# EAGLE design ZippyLighthouseCircuit_v15 (EAGLE 9.1.0)
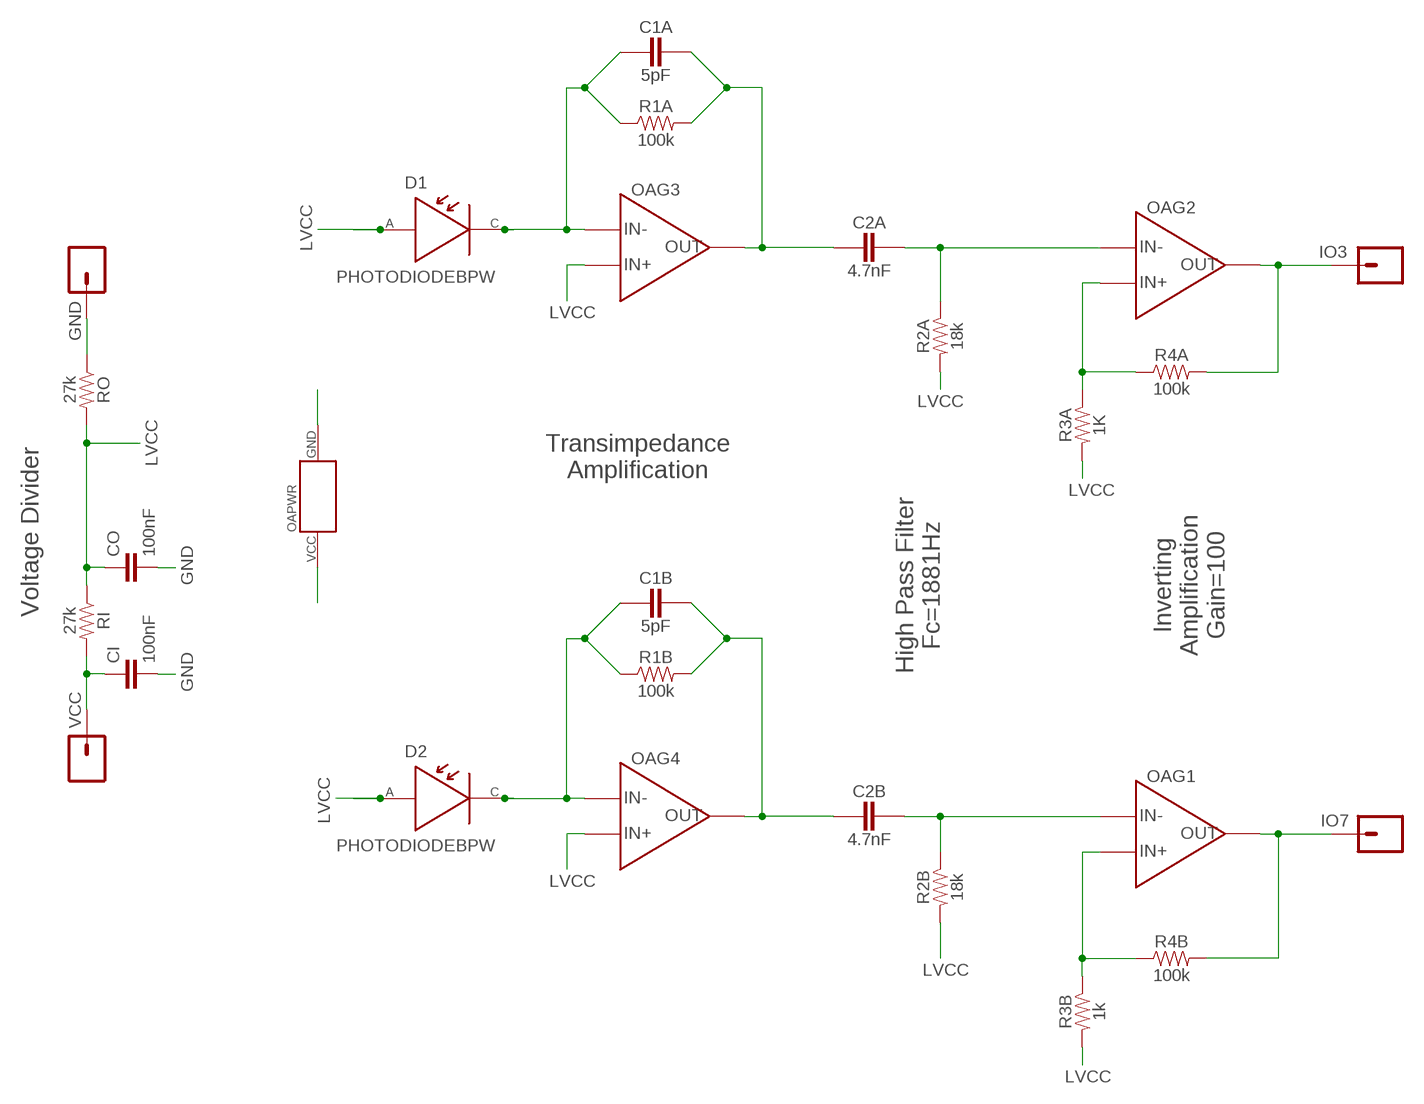
[diagram p0: schematic, sheet 1]

## Parts
C1A  5pF  CAPACITOR  [PASSIVE-0603]
C1B  5pF  CAPACITOR  [PASSIVE-0603]
C2A  4.7nF  CAPACITOR  [PASSIVE-0603]
C2B  4.7nF  CAPACITOR  [PASSIVE-0603]
CI  100nF  4.7PF-0603-50V-5%  [0603]
CO  100nF  4.7PF-0603-50V-5%  [0603]
D1  PHOTODIODEBPW  [BPW34_BP104_SMD]
D2  PHOTODIODEBPW  [BPW34_BP104_SMD]
GND  CONN_01PTH_NO_SILK_YES_STOP  [1X01_NO_SILK]
IO3  CONN_01PTH_NO_SILK_YES_STOP  [1X01_NO_SILK]
IO7  CONN_01PTH_NO_SILK_YES_STOP  [1X01_NO_SILK]
OA  TLV2464IDM  [D14-M]
R1A  100k  RESISTOR  [PASSIVE-0603]
R1B  100k  RESISTOR  [PASSIVE-0603]
R2A  18k  RESISTOR  [PASSIVE-0603]
R2B  18k  RESISTOR  [PASSIVE-0603]
R3A  1K  RESISTOR  [PASSIVE-0603]
R3B  1k  RESISTOR  [PASSIVE-0603]
R4A  100k  RESISTOR  [PASSIVE-0603]
R4B  100k  RESISTOR  [PASSIVE-0603]
RI  27k  100KOHM-0603-1/10W-1%  [0603]
RO  27k  100KOHM-0603-1/10W-1%  [0603]
VCC  CONN_01PTH_NO_SILK_YES_STOP  [1X01_NO_SILK]

## Nets
D1IN: C1B.1 D2.CATHODE OA.13(IN-) R1B.1
D1OA2P: C2B.2 OA.2(IN-) R2B.1
D1OAOUT1: C1B.2 C2B.1 OA.14(OUT) R1B.2
D2IN: C1A.1 D1.CATHODE OA.9(IN-) R1A.1
D2OA1OUT: C1A.2 C2A.1 OA.8(OUT) R1A.2
D2OA2N: OA.5(IN+) R3A.1 R4A.1
D2OA2P: C2A.2 OA.6(IN-) R2A.1
GND: CI.2 CO.2 GND.1 OA.11(PWR:GND) RO.1
IO3: IO3.1 OA.7(OUT) R4A.2
IO7: IO7.1 OA.1(OUT) R4B.2
LVCC: CO.1 D1.ANODE D2.ANODE OA.10(IN+) OA.12(IN+) R2A.2 R2B.2 R3A.2 R3B.2 RI.1 RO.2
N$11: OA.3(IN+) R3B.1 R4B.1
VCC: CI.1 OA.4(PWR:VCC) RI.2 VCC.1

## Notes on the sheet
- Transimpedance
  Amplification
- Voltage Divider
- High Pass Filter
  Fc=1881Hz
- Inverting
  Amplification
  Gain=100

## Library data of the parts
C1A C1B C2A C2B = ZippyComponentLibrary:CAPACITOR
CI CO = SparkFun-Capacitors:4.7PF: 4.7pF ceramic capacitors A capacitor is a passive two-terminal electrical component used to store electrical energy temporarily in an electric field.; PROD_ID: CAP-07880; VALUE: 4.7pF
D1 D2 = ZippyComponentLibrary:PHOTODIODE: "2x1 SMD Mounting Point For BPW34 Diode"
GND IO3 IO7 VCC = SparkFun-Connectors:CONN_01: Single connection point. Often used as Generic Header-pin footprint for 0.1 inch spaced/style header connections On any of the 0.1 inch spaced packages, you can populate with these: Break Away Headers - Straight <https://www.sparkfun.com/products/116> (PRT-00116) Break Away Male Headers - Right Angle <https://www.sparkfun.com/products/553> (PRT-00553) Female Headers <https://www.sparkfun.com/products/115> (PRT-00115) Break Away Headers - Machine Pin <https://www.sparkfun.com/products/117> (PRT-00117) Break Away Female Headers - Swiss Machine Pin <https://www.sparkfun.com/products/743> (PRT-00743) This device is also useful as a general connection point to wire up your design to another part of your project. Our various solder wires solder well into these plated through hole pads. Hook-Up Wire - Assortment (Stranded, 22 AWG) <https://www.sparkfun.com/products/11375> (PRT-11375) Hook-Up Wire - Assortment (Solid Core, 22 AWG) <https://www.sparkfun.com/products/11367> (PRT-11367) View the entire wire category on our website here <https://www.sparkfun.com/categories/141> Special notes: SMTSO-256-ET is a "flush mount" nut for a 4-40 screw. We mostly use this on specialty testbeds; it is a nice way to connect hardware to your PCB at an adjustable hieght. Also note, the SNAP packages are for using a snappable style connector. We sell a baggie of snaps and they are also used on two LilyPad designs: Snap Assortment - 30 pack (male and female) <https://www.sparkfun.com/products/11347> (DEV-11347) LilyPad Arduino SimpleSnap <https://www.sparkfun.com/products/10941> (DEV-10941) LilyPad SimpleSnap Protoboard <https://www.sparkfun.com/products/10940> (DEV-10940)
OA = ZippyComponentLibrary:TLV2464ID
R1A R1B R2A R2B R3A R3B R4A R4B = ZippyComponentLibrary:RESISTOR
RI RO = SparkFun-Resistors:100KOHM: 100kΩ resistor A resistor is a passive two-terminal electrical component that implements electrical resistance as a circuit element. Resistors act to reduce current flow, and, at the same time, act to lower voltage levels within circuits. - Wikipedia; PROD_ID: RES-07828; VALUE: 100k

## Board
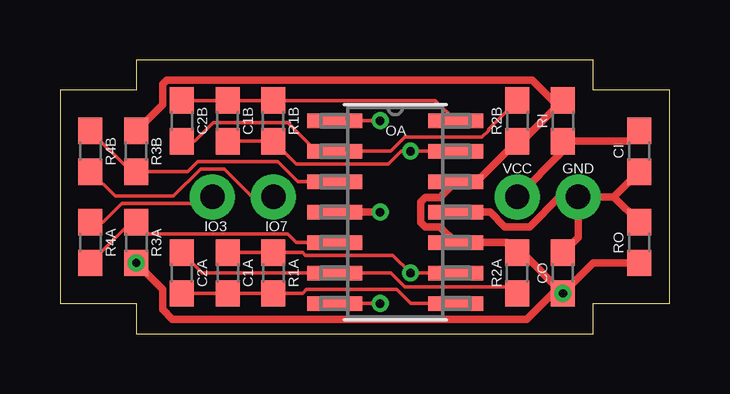
[diagram p1: board, top side]
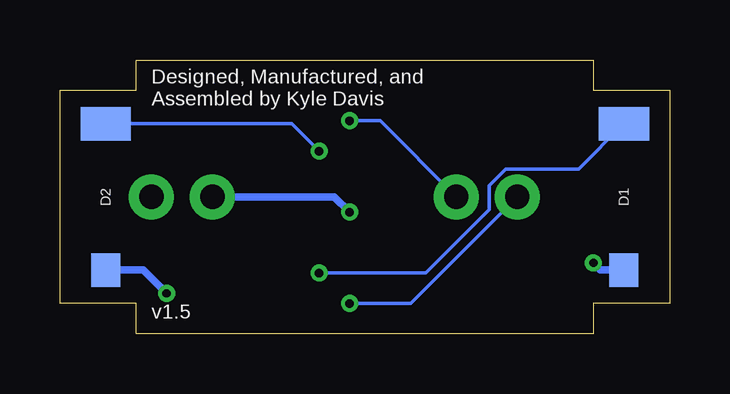
[diagram p2: board, bottom side, seen from below]

Size 25.4 x 11.43 mm. Coordinates in mm from the lower left corner, seen from the top.
Outline: 3.17,0 22.23,0 22.23,1.27 25.4,1.27 25.4,10.16 22.23,10.16 22.23,11.43 3.17,11.43 3.17,10.16 0,10.16 0,1.27 3.17,1.27 3.17,0
Copper layers (1*16): Top 0.0356mm / dielectric 1.5011mm / Bottom 0.0356mm
Design rules "LaenPCBOrder *": minimum track width 6mil, minimum drill 13mil, track to track 6mil, track to pad 6mil, pad to pad 6mil, via to via 6mil, smd to smd 6mil, copper to edge 15mil, drill to drill 6mil, minimum pad ring 7mil, minimum via ring 7mil, stop-mask expansion 3mil, vias tented up to drill 0mil, thermal gap 10mil

### Footprints (pad centres in the part's own frame; a part is rotated, then mirrored left to right if it is on the bottom)
PASSIVE-0603 = smd 1.1 x 1: 1 -0.85,0; 2 0.85,0
0603 = smd 1.1 x 1: 1 -0.85,0; 2 0.85,0
BPW34_BP104_SMD = smd 1.4 x 1.2: ANODE -3.05,0 | smd 1.4 x 2.1: CATHODE 3.05,0
1X01_NO_SILK = drill 1.016 pad 1.88: 1 0,0
D14-M = smd 2.286 x 0.61: 1 -2.515,3.81; 2 -2.515,2.54; 3 -2.515,1.27; 4 -2.515,0; 5 -2.515,-1.27; 6 -2.515,-2.54; 7 -2.515,-3.81; 8 2.515,-3.81; 9 2.515,-2.54; 10 2.515,-1.27; 11 2.515,0; 12 2.515,1.27; 13 2.515,2.54; 14 2.515,3.81

### Placement (x,y rotation side)
C1A  6.99,2.54 270 top
C1B  6.99,8.89 90 top
C2A  5.08,2.54 90 top
C2B  5.08,8.89 270 top
CI  24.13,7.62 270 top
CO  20.95,2.54 90 top
D1  1.91,5.71 90 bottom
D2  23.5,5.71 90 bottom
GND  21.59,5.71 0 top
IO3  6.35,5.71 0 top
IO7  8.89,5.71 0 top
OA  13.97,5.08 0 top
R1A  8.89,2.54 270 top
R1B  8.89,8.89 90 top
R2A  19.05,2.54 90 top
R2B  19.05,8.89 270 top
R3A  3.17,3.81 270 top
R3B  3.17,7.62 90 top
R4A  1.27,3.81 90 top
R4B  1.27,7.62 270 top
RI  20.95,8.89 270 top
RO  24.13,3.81 270 top
VCC  19.05,5.71 0 top

### Tracks (layer width: path | path; a pad name or v marks a point on that pad's centre or on a via)
D1IN  (via drill 0.35)
  Top 0.152: C1B.1 R1B.1 9.84,7.09 13.68,7.09 14.21,7.62 v14.61,7.62 OA.13
  Bottom 0.152: v14.61,7.62 15.75,8.77 D2.CATHODE
D1OA2P
  Top 0.152: R2B.1 17.86,8.55 17.86,8.49 17.57,8.2 14.36,8.2 13.78,7.62 OA.2 10.68,7.62 9.48,8.82 6.39,8.82 5.61,8.04 C2B.2
D1OAOUT1
  Top 0.152: C2B.1 C1B.2 R1B.2 15.63,9.74 OA.14
D2IN  (via drill 0.35)
  Top 0.152: C1A.1 R1A.1 10.1,3.39 10.22,3.28 13.87,3.28 v14.61,2.54 OA.9
  Bottom 0.152: v14.61,2.54 10.16,2.54 7.52,5.18 7.52,6.2 6.83,6.88 3.79,6.88 D1.CATHODE
D2OA1OUT
  Top 0.152: C2A.1 C1A.2 R1A.2 10.1,1.69 10.27,1.85 14.02,1.85 14.61,1.27 OA.8
D2OA2N
  Top 0.152: R4A.1 2.97,4.66 R3A.1 3.67,4.17 9.48,4.17 9.84,3.81 OA.5
D2OA2P
  Top 0.152: C2A.2 5.93,2.54 OA.6 13.78,2.54 14.36,1.96 18.78,1.96 R2A.1
GND
  Top 0.305: CO.2 21.59,4.03 GND.1 | RO.1 23.07,5.71 | GND.1 23.07,5.71 | 23.07,5.71 CI.2 | GND.1 20.81,5.71 19.57,4.47 18.53,4.47 17.93,5.08 OA.11
IO3  (via drill 0.35)
  Top 0.152: OA.7 v13.34,1.27 | R4A.2 1.8,4.66 2.58,5.44 6.07,5.44 IO3.1
  Bottom 0.152: IO3.1 10.79,1.27 v13.34,1.27
IO7  (via drill 0.35)
  Top 0.152: OA.1 v13.34,8.89 | IO7.1 8,5.71 6.83,6.88 5.87,6.88 4.73,5.74 2.3,5.74 R4B.2
  Bottom 0.152: v13.34,8.89 12.06,8.89 IO7.1
LVCC  (via drill 0.35)
  Top 0.305: CO.1 19.25,3.39 R2A.2 18.63,3.81 OA.10 15.82,4.47 15.21,4.47 15.04,4.65 15.04,5.51 15.21,5.69 15.82,5.69 OA.12 17.36,6.35 R2B.2 19.25,8.04 RI.1 20.53,9.74 19.68,10.6 4.45,10.6 4.28,10.42 4.28,9.57 R3B.2 | RO.2 22.23,2.96 CO.1 | R3A.2 4.28,1.86 4.28,1.01 4.68,0.61 19.45,0.61 20.53,1.69 CO.1
  Bottom 0.305: CO.1 21.93,2.67 D2.ANODE | D1.ANODE 2.88,2.67 R3A.2
  other vias: 20.95,1.69 3.17,2.96
N$11
  Top 0.152: R4B.1 2.97,6.77 R3B.1 5.32,6.77 5.74,7.19 9.07,7.19 9.91,6.35 OA.3
VCC  (via drill 0.35)
  Top 0.305: CI.1 23.7,8.04 RI.2 20.95,7.62 VCC.1 | v13.34,5.08 OA.4
  Bottom 0.305: VCC.1 13.97,5.71 v13.34,5.08

### Text on the board
bPlace: Designed, Manufactured, and / Assembled by Kyle Davis | v1.5